# EAGLE design CNY (EAGLE 9.6.2)
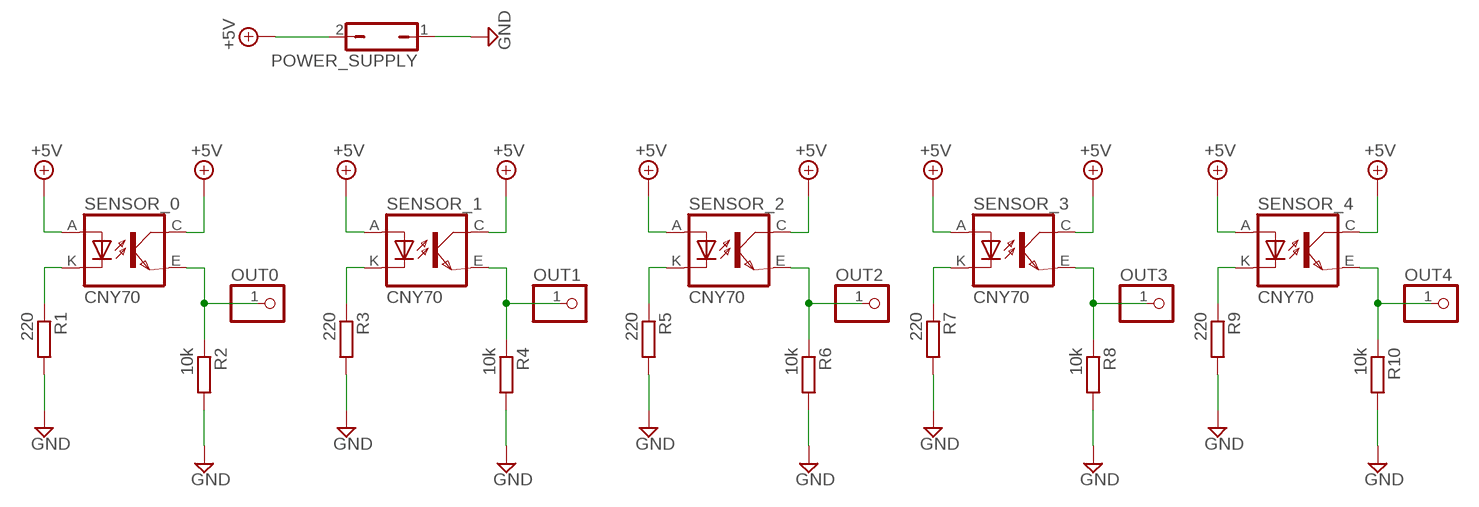
[diagram p0: schematic, sheet 1]

## Parts
OUT0  PINHD-1X1  [1X01]
OUT1  PINHD-1X1  [1X01]
OUT2  PINHD-1X1  [1X01]
OUT3  PINHD-1X1  [1X01]
OUT4  PINHD-1X1  [1X01]
POWER_SUPPLY  JP1Q  [JP1]
R1  220  R-EU_0204/5  [0204/5]
R2  10k  R-EU_0204/5  [0204/5]
R3  220  R-EU_0204/5  [0204/5]
R4  10k  R-EU_0204/5  [0204/5]
R5  220  R-EU_0204/5  [0204/5]
R6  10k  R-EU_0204/5  [0204/5]
R7  220  R-EU_0204/5  [0204/5]
R8  10k  R-EU_0204/5  [0204/5]
R9  220  R-EU_0204/5  [0204/5]
R10  10k  R-EU_0204/5  [0204/5]
SENSOR_0  CNY70  [4]
SENSOR_1  CNY70  [4]
SENSOR_2  CNY70  [4]
SENSOR_3  CNY70  [4]
SENSOR_4  CNY70  [4]

## Nets
+5V: POWER_SUPPLY.2 SENSOR_0.A SENSOR_0.C(COL) SENSOR_1.A SENSOR_1.C(COL) SENSOR_2.A SENSOR_2.C(COL) SENSOR_3.A SENSOR_3.C(COL) SENSOR_4.A SENSOR_4.C(COL)
GND: POWER_SUPPLY.1 R1.2 R2.2 R3.2 R4.2 R5.2 R6.2 R7.2 R8.2 R9.2 R10.2
N$1: R1.1 SENSOR_0.K(C)
N$2: R3.1 SENSOR_1.K(C)
N$3: OUT1.1 R4.1 SENSOR_1.E(EMI)
N$4: R5.1 SENSOR_2.K(C)
N$5: OUT2.1 R6.1 SENSOR_2.E(EMI)
N$6: R7.1 SENSOR_3.K(C)
N$7: OUT3.1 R8.1 SENSOR_3.E(EMI)
N$8: R9.1 SENSOR_4.K(C)
N$9: OUT4.1 R10.1 SENSOR_4.E(EMI)
N$11: OUT0.1 R2.1 SENSOR_0.E(EMI)

## Library data of the parts
OUT0 OUT1-OUT4 = pinhead:PINHD-1X1: PIN HEADER
POWER_SUPPLY = jumper:JP1Q: JUMPER
R1-R10 = rcl:R-EU_: RESISTOR, European symbol; SPICEPREFIX: R
SENSOR_0 SENSOR_1-SENSOR_4 = cny70:CNY70

## Board
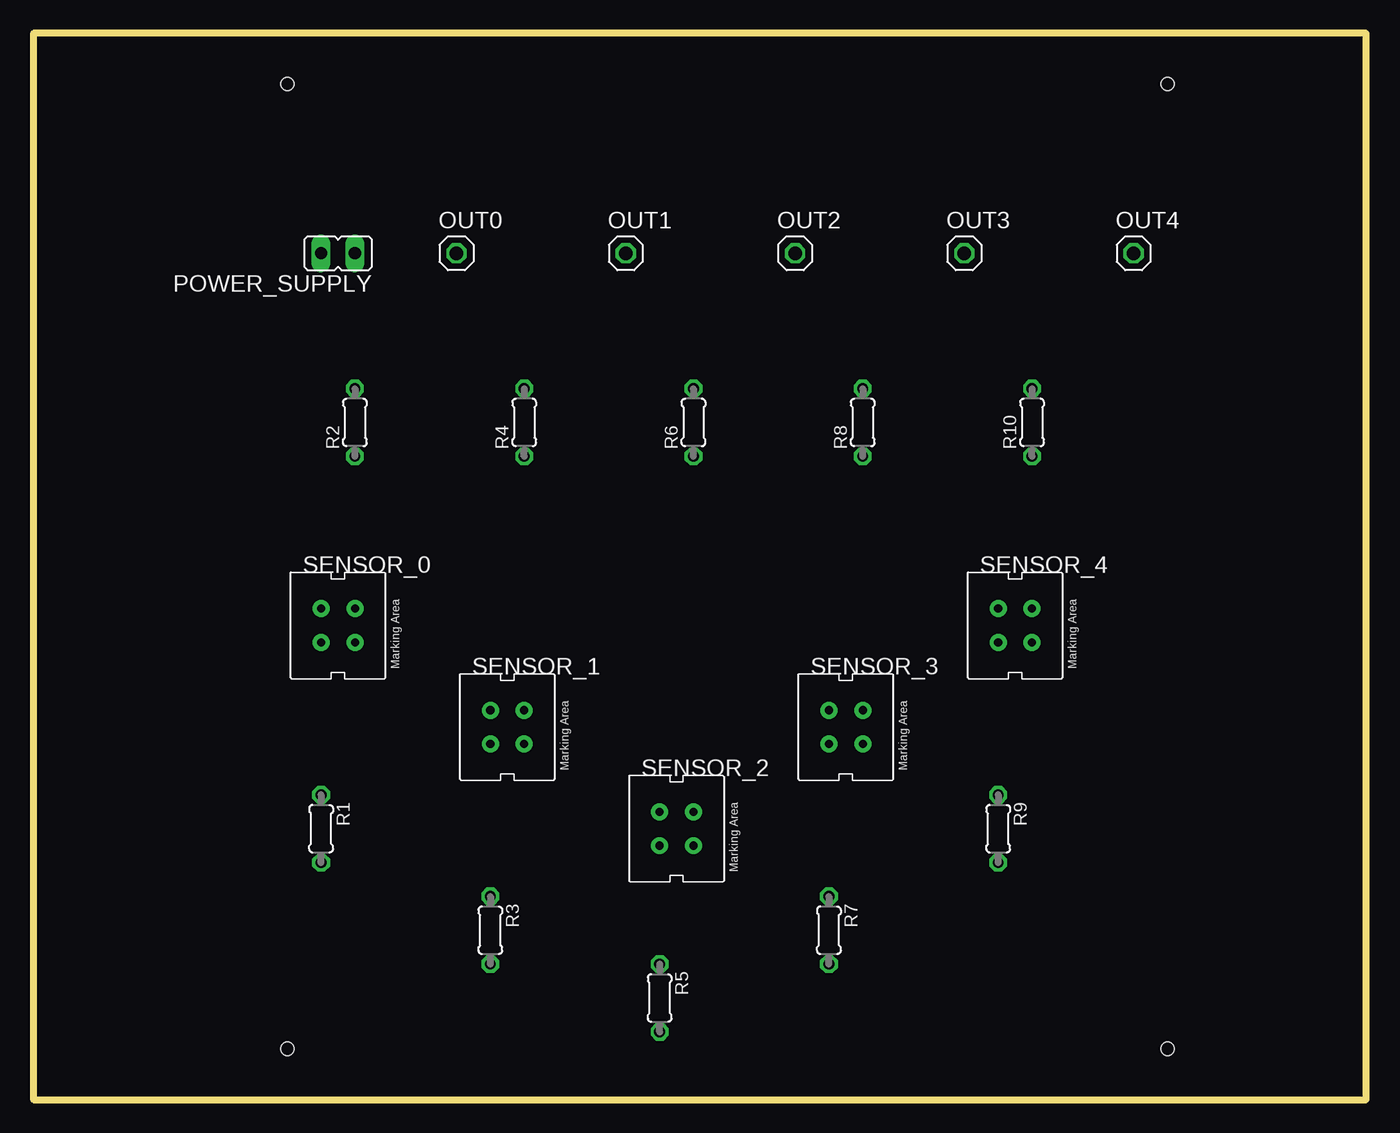
[diagram p1: board, top side]
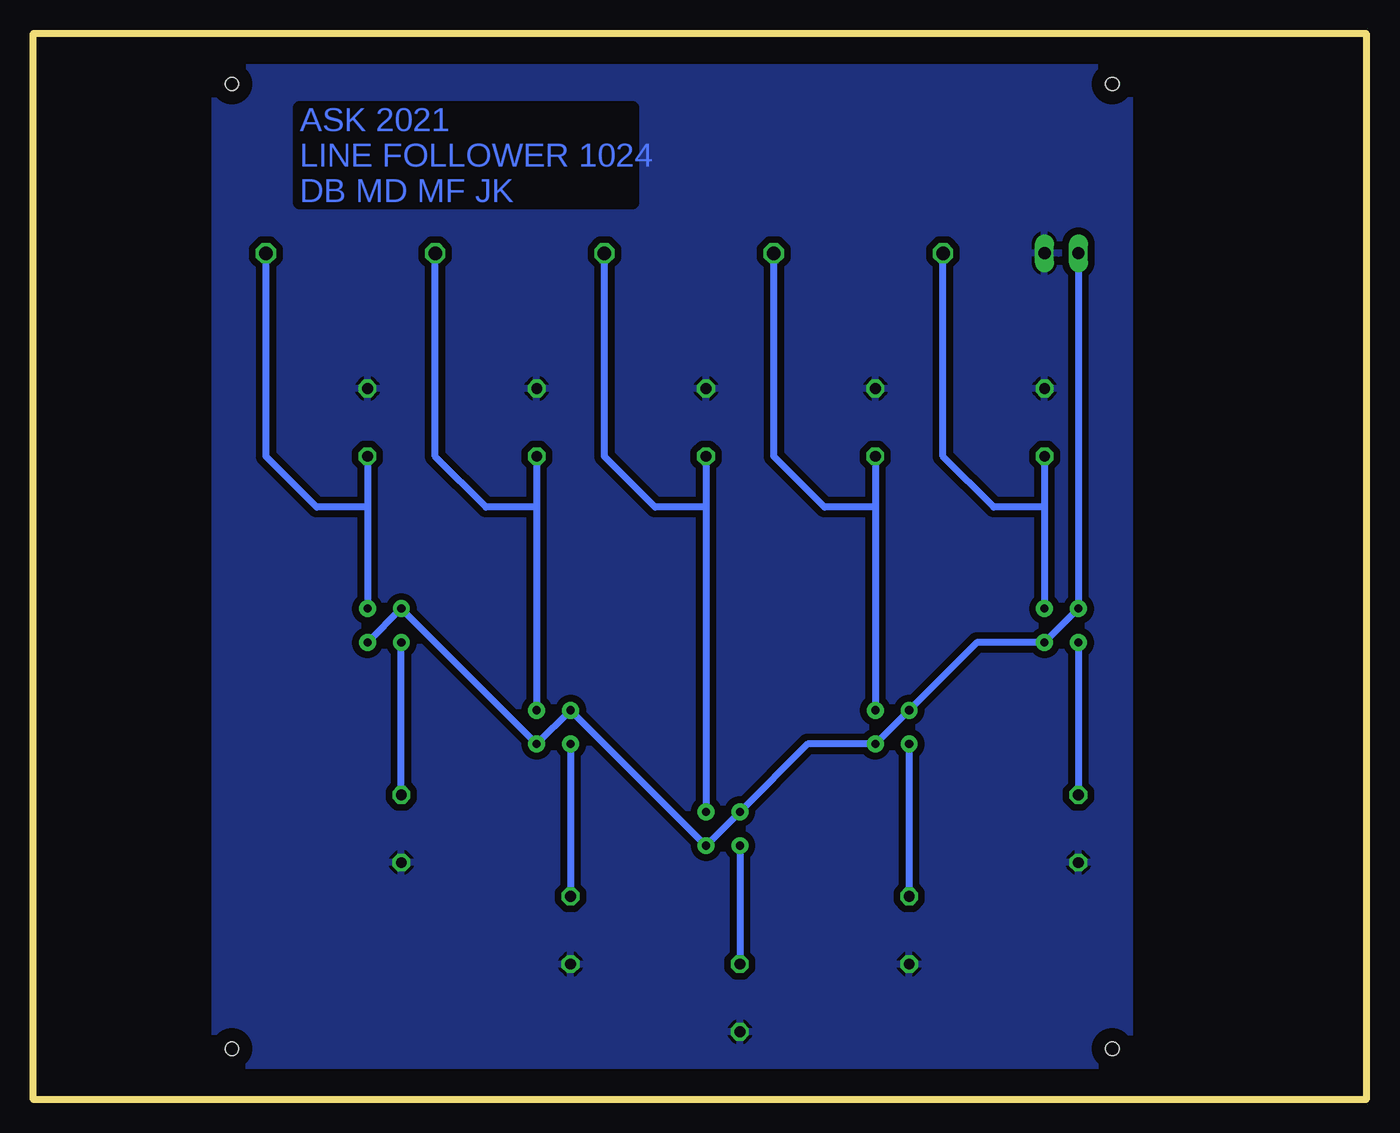
[diagram p2: board, bottom side, seen from below]

Size 100 x 80 mm. Coordinates in mm from the lower left corner, seen from the top.
Outline: 0,0 100,0 100,80 0,80 0,0
Copper layers (1*16): Top 0.035mm / dielectric 1.5mm / Bottom 0.035mm
Design rules "default": minimum track width 6mil, minimum drill 0.35mm, track to track 6mil, track to pad 6mil, pad to pad 6mil, via to via 6mil, smd to smd 6mil, copper to edge 40mil, drill to drill 6mil, minimum pad ring 10mil, minimum via ring 8mil, stop-mask expansion 4mil, vias tented up to drill 0mil, thermal gap 10mil
Holes 1 mm at 19.05,3.81 85.09,3.81 85.09,76.2 19.05,76.2

### Footprints (pad centres in the part's own frame; a part is rotated, then mirrored left to right if it is on the bottom)
1X01 = drill 1.016 octagon: 1 0,0
JP1 = drill 0.914 long: 1 0,-1.27; 2 0,1.27
0204/5 = drill 0.813 octagon: 1 -2.54,0; 2 2.54,0
4 = drill 0.61 pad 1.27: A -1.27,1.27; C 1.27,-1.27; E 1.27,1.27; K -1.27,-1.27

### Placement (x,y rotation side)
OUT0  31.75,63.5 0 top
OUT1  44.45,63.5 0 top
OUT2  57.15,63.5 0 top
OUT3  69.85,63.5 0 top
OUT4  82.55,63.5 0 top
POWER_SUPPLY  22.86,63.5 90 top
R1  21.59,20.32 270 top
R2  24.13,50.8 90 top
R3  34.29,12.7 270 top
R4  36.83,50.8 90 top
R5  46.99,7.62 270 top
R6  49.53,50.8 90 top
R7  59.69,12.7 270 top
R8  62.23,50.8 90 top
R9  72.39,20.32 270 top
R10  74.93,50.8 90 top
SENSOR_0  22.86,35.56 0 top
SENSOR_1  35.56,27.94 0 top
SENSOR_2  48.26,20.32 0 top
SENSOR_3  60.96,27.94 0 top
SENSOR_4  73.66,35.56 0 top

### Tracks (layer width: path | path; a pad name or v marks a point on that pad's centre or on a via)
+5V
  Bottom 0.508: POWER_SUPPLY.2 SENSOR_0.A SENSOR_0.C 29.21,34.29 SENSOR_1.A SENSOR_1.C 41.91,26.67 SENSOR_2.A SENSOR_2.C SENSOR_3.A SENSOR_3.C SENSOR_4.A SENSOR_4.C
GND
  pour Bottom (isolate 0.508): 17.78,77.47 17.78,2.54 86.36,2.54 86.36,77.47
N$1
  Bottom 0.508: SENSOR_0.K R1.1
N$2
  Bottom 0.508: SENSOR_1.K R3.1
N$3
  Bottom 0.508: R4.1 36.83,44.45 | 36.83,44.45 SENSOR_1.E | 36.83,44.45 40.64,44.45 44.45,48.26 OUT1.1
N$4
  Bottom 0.508: SENSOR_2.K R5.1
N$5
  Bottom 0.508: R6.1 49.53,44.45 | 49.53,44.45 SENSOR_2.E | OUT2.1 57.15,48.26 53.34,44.45 49.53,44.45
N$6
  Bottom 0.508: SENSOR_3.K R7.1
N$7
  Bottom 0.508: R8.1 62.23,44.45 | 62.23,44.45 SENSOR_3.E | 62.23,44.45 66.04,44.45 69.85,48.26 OUT3.1
N$8
  Bottom 0.508: R9.1 SENSOR_4.K
N$9
  Bottom 0.508: R10.1 74.93,44.45 | 74.93,44.45 SENSOR_4.E | 74.93,44.45 78.74,44.45 82.55,48.26 OUT4.1
N$11
  Bottom 0.508: R2.1 24.13,44.45 | 24.13,44.45 SENSOR_0.E | 24.13,44.45 27.94,44.45 31.75,48.26 OUT0.1

### Text on the board
Bottom: ASK 2021 / LINE FOLLOWER 1024 / DB MD MF JK